# Altium schematic sheet Gate_Drive.SchDoc
size A4; SheetNumber: 3; SheetTotal: 4
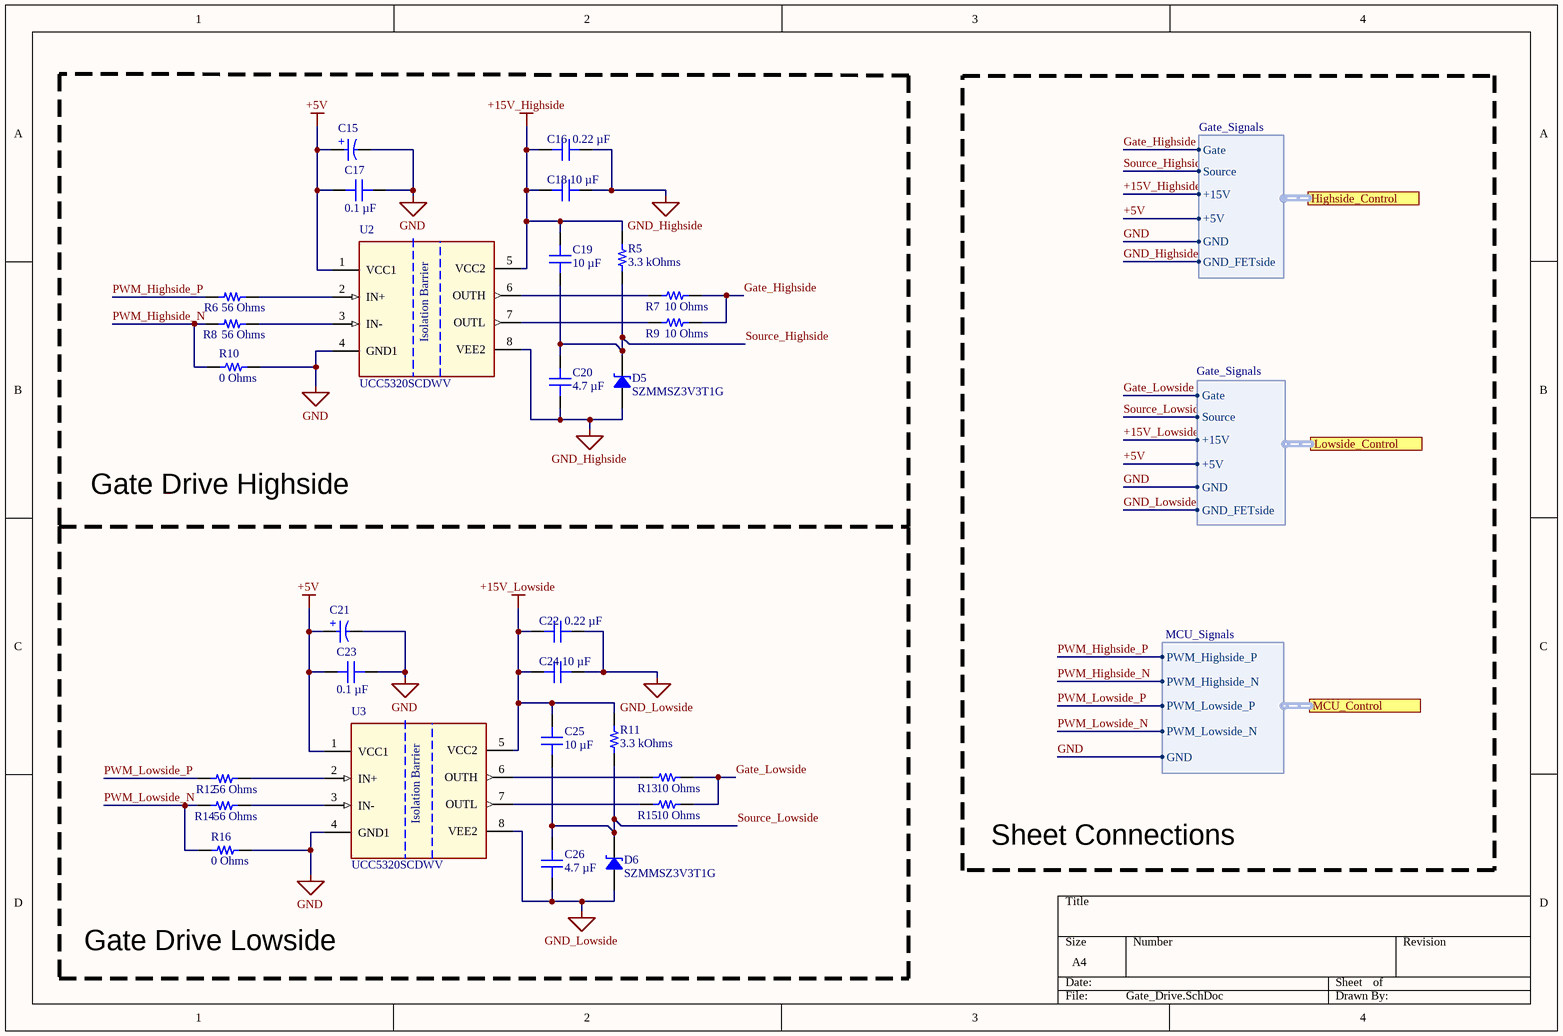
[diagram p0: Gate_Drive.SchDoc]

## Parts
C15  1uF  [WCAP-ATG5_D5H11]  (value not drawn)
C16  0.22 µF  [CAP 0805_2012]
C17  0.1 µF  [CAP 0805_2012]
C18  10 µF  [CAP 0805_2012]
C19  10 µF  [CAP 0805_2012]
C20  4.7 µF  [CAP 0805_2012]
C21  1uF  [WCAP-ATG5_D5H11]  (value not drawn)
C22  0.22 µF  [CAP 0805_2012]
C23  0.1 µF  [CAP 0805_2012]
C24  10 µF  [CAP 0805_2012]
C25  10 µF  [CAP 0805_2012]
C26  4.7 µF  [CAP 0805_2012]
D5  SZMMSZ3V3T1G  [SOD-123]
D6  SZMMSZ3V3T1G  [SOD-123]
R5  3.3 kOhms  [RES 0805_2012]
R6  56 Ohms  [RES 0805_2012]
R7  10 Ohms  [RES 0805_2012]
R8  56 Ohms  [RES 0805_2012]
R9  10 Ohms  [RES 0805_2012]
R10  0 Ohms  [RES 0805_2012]
R11  3.3 kOhms  [RES 0805_2012]
R12  56 Ohms  [RES 0805_2012]
R13  10 Ohms  [RES 0805_2012]
R14  56 Ohms  [RES 0805_2012]
R15  10 Ohms  [RES 0805_2012]
R16  0 Ohms  [RES 0805_2012]
U2  UCC5320SCDWV  [DWV0008A]
U3  UCC5320SCDWV  [DWV0008A]

## Blocks framed on the sheet
Gate Drive Highside: C15-C20 D5 R5-R10 U2

## Ports
Highside_Control (harness Gate_Signals), Lowside_Control (harness Gate_Signals), MCU_Control (harness MCU_Signals)

## Harnesses
Gate_Signals: Gate, Source, +15V, +5V, GND, GND_FETside
MCU_Signals: PWM_Highside_P, PWM_Highside_N, PWM_Lowside_P, PWM_Lowside_N, GND

## Nets
+5V: C15.1(P) C17.1 C21.1(P) C23.1 U2.1(VCC1) U3.1(VCC1) ; port Lowside_Control.+5V, port Highside_Control.+5V
+15V_Highside: C16.1 C18.2 C19.2 R5.2 U2.5(VCC2) ; port Highside_Control.+15V
+15V_Lowside: C22.1 C24.2 C25.2 R11.2 U3.5(VCC2) ; port Lowside_Control.+15V
GND: C15.2(N) C17.2 C21.2(N) C23.2 R10.2 R16.2 U2.4(GND1) U3.4(GND1) ; port Lowside_Control.GND, port Highside_Control.GND, port MCU_Control.GND
GND_Highside: C16.2 C18.1 C20.1 D5.1 U2.8(VEE2) ; port Highside_Control.GND_FETside
GND_Lowside: C22.2 C24.1 C26.1 D6.1 U3.8(VEE2) ; port Lowside_Control.GND_FETside
Gate_Highside: R7.2 R9.2 ; port Highside_Control.Gate
Gate_Lowside: R13.2 R15.2 ; port Lowside_Control.Gate
PWM_Highside_N: R8.1 R10.1 ; port MCU_Control.PWM_Highside_N
PWM_Highside_P: R6.1 ; port MCU_Control.PWM_Highside_P
PWM_Lowside_N: R14.1 R16.1 ; port MCU_Control.PWM_Lowside_N
PWM_Lowside_P: R12.1 ; port MCU_Control.PWM_Lowside_P
Source_Highside: C19.1 C20.2 D5.2 R5.1 ; port Highside_Control.Source
Source_Lowside: C25.1 C26.2 D6.2 R11.1 ; port Lowside_Control.Source
NetR6_2: R6.2 U2.2(IN+)
NetR7_1: R7.1 U2.6(OUTH)
NetR8_2: R8.2 U2.3(IN-)
NetR9_1: R9.1 U2.7(OUTL)
NetR12_2: R12.2 U3.2(IN+)
NetR13_1: R13.1 U3.6(OUTH)
NetR14_2: R14.2 U3.3(IN-)
NetR15_1: R15.1 U3.7(OUTL)

## Notes on the sheet
- Sheet Connections
- Gate Drive Lowside
- (in symbol 860020672005) +
- (in symbol UCC5320SCDWV) Isolation Barrier

## Library data of the parts
C15 C21 = 860020672005: WCAP-ATG5 Aluminum Electrolytic Capacitor, Radial, THT, D5 x H11mm, 1µF, 50V; Manufacturer: Wurth Elektronik; Capacitance Tolerance: +/-20%; Dissipation Factor: 10%; Endurance: 2000h; Leakage Current: 3uA; Ripple Current: 13mA; Technical Reference: ATDC110010M050DSPA3B000; Manufacturer Part Number: 860020672005; Category: Aluminum Electrolytic Capacitors; Match Code: WCAP-ATG5; ComponentLink1Description: Website Link; ComponentLink1URL: https://www.we-online.com/redexpert/article/860020672005?ad; ComponentLink2Description: Datasheet Link; ComponentLink2URL: https://www.we-online.com/redexpert/spec/860020672005?ad; Mount: Through Hole; Operating Temperature Max: 105°C; Operating Temperature Min: -40°C; Packaging: Ammo Pack; Height: 11mm; Diameter: 5mm; Capacitance: 1uF; Rated Voltage (DC): 50V
C16 C22 = VJ0805Y224KXXTW1BC: CAP CER 0.22UF 25V X7R 0805; manufacturer: Vishay Vitramon; Tolerance: ±10%; Part Number: VJ0805Y224KXXTW1BC; Value: 0.22 µF; Applications: General Purpose; Capacitance: 0.22 µF; componentlink1description: Datasheet; componentlink1url: https://www.vishay.com/docs/28548/vjw1bcbascomseries.pdf; componentlink2description: DigiKey Link; componentlink2url: https://www.digikey.com/en/products/detail/vishay-vitramon/VJ0805Y224KXXTW1BC/8312077; Device Package: 0805 (2012 Metric); lastupdated: 9.02.2024 20:15:18; Lifecycle Status: Active; Minimum Order: 1; Mounting Type: Surface Mount, MLCC; Operating Temperature: -55°C ~ 125°C; Package / Case: 0805 (2012 Metric); packaging: TapeAndReel; partid: 26430; Part Status: Active; price: 0.04; series: VJ W1BC; Size / Dimension: 0.079" L x 0.049" W (2.00mm x 1.25mm); Supplier 1: DigiKey; Supplier Part Number 1: 720-VJ0805Y224KXXTW1BCCT-ND; Temperature Coefficient: X7R; Thickness (Max): 0.053" (1.35mm); Voltage - Rated: 25V
C17 C23 = VJ0805Y104MXAMR: CAP CER 0.1UF 50V X7R 0805; manufacturer: Vishay Vitramon; Tolerance: ±20%; Part Number: VJ0805Y104MXAMR; Value: 0.1 µF; Applications: General Purpose; Capacitance: 0.1 µF; componentlink1description: Datasheet; componentlink1url: http://www.vishay.com/docs/45199/vjcommercialseries.pdf; componentlink2description: DigiKey Link; componentlink2url: https://www.digikey.com/en/products/detail/vishay-vitramon/VJ0805Y104MXAMR/8311084; Device Package: 0805 (2012 Metric); lastupdated: 9.02.2024 20:15:36; Lifecycle Status: Active; Minimum Order: 1; Mounting Type: Surface Mount, MLCC; Operating Temperature: -55°C ~ 150°C; Package / Case: 0805 (2012 Metric); packaging: TapeAndReel; partid: 14439; Part Status: Active; price: 0.09; series: VJ; Size / Dimension: 0.079" L x 0.049" W (2.00mm x 1.25mm); Supplier 1: DigiKey; Supplier Part Number 1: 720-1755-1-ND; Temperature Coefficient: X7R; Thickness (Max): 0.057" (1.45mm); Voltage - Rated: 50V
C18 C19 C24 C25 = TMK212BC6106MG-T: CAP CER 10UF 25V X6S 0805; manufacturer: Taiyo Yuden; Tolerance: ±20%; Part Number: TMK212BC6106MG-T; Value: 10 µF; Applications: SMPS Filtering; Capacitance: 10 µF; componentlink1description: Datasheet; componentlink1url: https://ds.yuden.co.jp/TYCOMPAS/ut/detail?pn=TMK212BC6106MG-T&u=M; componentlink2description: DigiKey Link; componentlink2url: https://www.digikey.com/en/products/detail/taiyo-yuden/TMK212BC6106MG-T/11675671; Device Package: 0805 (2012 Metric); lastupdated: 9.02.2024 20:15:02; Lifecycle Status: Active; Minimum Order: 1; Mounting Type: Surface Mount, MLCC; Operating Temperature: -55°C ~ 105°C; Package / Case: 0805 (2012 Metric); packaging: TapeAndReel; partid: 31493; Part Status: Active; price: 0.17; series: M; Size / Dimension: 0.079" L x 0.049" W (2.00mm x 1.25mm); Supplier 1: DigiKey; Supplier Part Number 1: 587-TMK212BC6106MG-TCT-ND; Temperature Coefficient: X6S; Thickness (Max): 0.057" (1.45mm); Voltage - Rated: 25V
C20 C26 = VJ0805V475ZXQTW1BC: CAP CER 4.7UF 10V Y5V 0805; manufacturer: Vishay Vitramon; Temperature Coefficient: Y5V (F); Tolerance: -20%, +80%; Part Number: VJ0805V475ZXQTW1BC; Value: 4.7 µF; Applications: General Purpose; Capacitance: 4.7 µF; componentlink1description: Datasheet; componentlink1url: https://www.vishay.com/docs/28548/vjw1bcbascomseries.pdf; componentlink2description: DigiKey Link; componentlink2url: https://www.digikey.com/en/products/detail/vishay-vitramon/VJ0805V475ZXQTW1BC/8310746; Device Package: 0805 (2012 Metric); lastupdated: 9.02.2024 20:15:54; Lifecycle Status: Active; Minimum Order: 1; Mounting Type: Surface Mount, MLCC; Operating Temperature: -25°C ~ 85°C; Package / Case: 0805 (2012 Metric); packaging: TapeAndReel; partid: 7977; Part Status: Active; price: 0.06; series: VJ; Size / Dimension: 0.079" L x 0.049" W (2.00mm x 1.25mm); Supplier 1: DigiKey; Supplier Part Number 1: 720-1738-1-ND; Thickness (Max): 0.053" (1.35mm); Voltage - Rated: 10V
D5 D6 = SZMMSZ3V3T1G: DIODE ZENER 3.3V 500MW SOD123; Manufacturer: ON Semiconductor; Current - Reverse Leakage @ Vr: 5µA @ 1V; Impedance (Max) (Zzt): 95 Ohms; Tolerance: ±5%; Voltage - Forward (Vf) (Max) @ If: 900mV @ 10mA; Part Number: SZMMSZ3V3T1G; ComponentLink1Description: Datasheet; ComponentLink1URL: http://www.onsemi.com/pub/Collateral/MMSZ2V4T1-D.PDF; ComponentLink2Description: DigiKey Link; ComponentLink2URL: http://digikey.com/product-detail/en/on-semiconductor/SZMMSZ3V3T1G/SZMMSZ3V3T1GOSCT-ND/9087911; LastUpdated: 3.06.2024 19:55:41; Lifecycle Status: Active; Minimum Order: 1; Mounting Type: Surface Mount; Operating Temperature: -55°C ~ 150°C; Package / Case: SOD-123; Packaging: TapeAndReel; PartId: 2464; Part Status: Active; Power - Max: 500mW; Price: 0.05; Series: Automotive, AEC-Q101; Supplier 1: DigiKey; Supplier Part Number 1: SZMMSZ3V3T1GOSCT-ND; Supplier Device Package: SOD-123; Voltage - Zener (Nom) (Vz): 3.3V
R5 R11 = CPF0805B3K3E1: RES SMD 3.3K OHM 0.1% 1/10W 0805; Manufacturer: TE Connectivity Passive Product; Power (Watts): 0.1W, 1/10W; Temperature Coefficient: ±25ppm/°C; Part Number: CPF0805B3K3E1; Value: 3.3 kOhms; ComponentLink1Description: Datasheet; ComponentLink1URL: https://www.te.com/commerce/DocumentDelivery/DDEController?Action=srchrtrv&DocNm=1773200&DocType=DS&DocLang=English; ComponentLink2Description: DigiKey Link; ComponentLink2URL: https://www.digikey.com/en/products/detail/te-connectivity-passive-product/CPF0805B3K3E1/2389807; Composition: Thin Film; Device Package: 0805 (2012 Metric); Height - Seated (Max): 0.026" (0.65mm); LastUpdated: 8.02.2024 21:02:11; Lifecycle Status: Active; Minimum Order: 1; Number of Terminations: 2; Operating Temperature: -55°C ~ 155°C; Package / Case: 0805 (2012 Metric); Packaging: TapeAndReel; PartId: 34198; Part Status: Active; Price: 0.12; Resistance: 3.3 kOhms; Series: CPF, Neohm; Size / Dimension: 0.079" L x 0.049" W (2.00mm x 1.25mm); Supplier 1: DigiKey; Supplier Part Number 1: A102339CT-ND; Supplier Device Package: 0805; Tolerance: ±0.1%
R6 R8 R12 R14 = 3430A2F56RTDF: 3430 A2 1% 56R 100PPM 1K RL; Manufacturer: TE Connectivity Passive Product; Power (Watts): 1W; Temperature Coefficient: ±100ppm/°C; Part Number: 3430A2F56RTDF; Value: 56 Ohms; ComponentLink2Description: DigiKey Link; ComponentLink2URL: https://www.digikey.com/en/products/detail/te-connectivity-passive-product/3430A2F56RTDF/17763508; Composition: Thick Film; Device Package: 0805 (2012 Metric); Features: Automotive AEC-Q200; Height - Seated (Max): 0.026" (0.65mm); LastUpdated: 8.02.2024 21:00:05; Lifecycle Status: Active; Minimum Order: 1; Number of Terminations: 2; Operating Temperature: -55°C ~ 155°C; Package / Case: 0805 (2012 Metric); Packaging: TapeAndReel; PartId: 77356; Part Status: Active; Price: 0.02; Ratings: AEC-Q200; Resistance: 56 Ohms; Series: 3430; Size / Dimension: 0.049" L x 0.079" W (1.25mm x 2.00mm); Supplier 1: DigiKey; Supplier Part Number 1: 1712-3430A2F56RTDFCT-ND; Supplier Device Package: 0508; Tolerance: ±1%
R7 R9 R13 R15 = 3430A2F10RTDF: 3430 A2 1% 10R 100PPM 1K RL; Manufacturer: TE Connectivity Passive Product; Power (Watts): 1W; Temperature Coefficient: ±100ppm/°C; Part Number: 3430A2F10RTDF; Value: 10 Ohms; ComponentLink2Description: DigiKey Link; ComponentLink2URL: https://www.digikey.com/en/products/detail/te-connectivity-passive-product/3430A2F10RTDF/17763496; Composition: Thick Film; Device Package: 0805 (2012 Metric); Features: Automotive AEC-Q200; Height - Seated (Max): 0.026" (0.65mm); LastUpdated: 8.02.2024 21:00:12; Lifecycle Status: Active; Minimum Order: 1; Number of Terminations: 2; Operating Temperature: -55°C ~ 155°C; Package / Case: 0805 (2012 Metric); Packaging: TapeAndReel; PartId: 76305; Part Status: Active; Price: 0.02; Ratings: AEC-Q200; Resistance: 10 Ohms; Series: 3430; Size / Dimension: 0.049" L x 0.079" W (1.25mm x 2.00mm); Supplier 1: DigiKey; Supplier Part Number 1: 1712-3430A2F10RTDFCT-ND; Supplier Device Package: 0508; Tolerance: ±1%
R10 R16 = 5106: RES SMD 0 OHM JUMPER 1/2W 0805; Part Number: 5106; Manufacturer: Keystone Electronics; Power (Watts): 0.5W, 1/2W; Value: 0 Ohms; ComponentLink1Description: Datasheet; ComponentLink1URL: http://keyelco.com/userAssets/file/M65p54.pdf; ComponentLink2Description: DigiKey Link; ComponentLink2URL: https://www.digikey.com/en/products/detail/keystone-electronics/5106/5118868; Composition: Metal Element; Device Package: 0805 (2012 Metric); Height - Seated (Max): 0.028" (0.71mm); LastUpdated: 8.02.2024 21:01:27; Lifecycle Status: Active; Minimum Order: 1; Number of Terminations: 2; Package / Case: 0805 (2012 Metric); Packaging: TapeAndReel; PartId: 44373; Part Status: Active; Price: 0.16; Resistance: 0 Ohms; Series: -; Size / Dimension: 0.079" L x 0.049" W (2.00mm x 1.25mm); Supplier 1: DigiKey; Supplier Part Number 1: 36-5106CT-ND; Supplier Device Package: 0805; Tolerance: Jumper
U2 U3 = UCC5320SCDWV: 3k/5kVrms, 2A/2A single-channel isolated gate driver with UVLO referenced to GND or split output 8-SOIC -40 to 125; Manufacturer_Name: Texas Instruments; TYPE: TYPE; RefDes: RefDes; Copyright: Copyright (C) 2025 Ultra Librarian. All rights reserved.; Manufacturer_Part_Number: UCC5320SCDWV; Datasheet: https://www.ti.com/lit/gpn/ucc5320